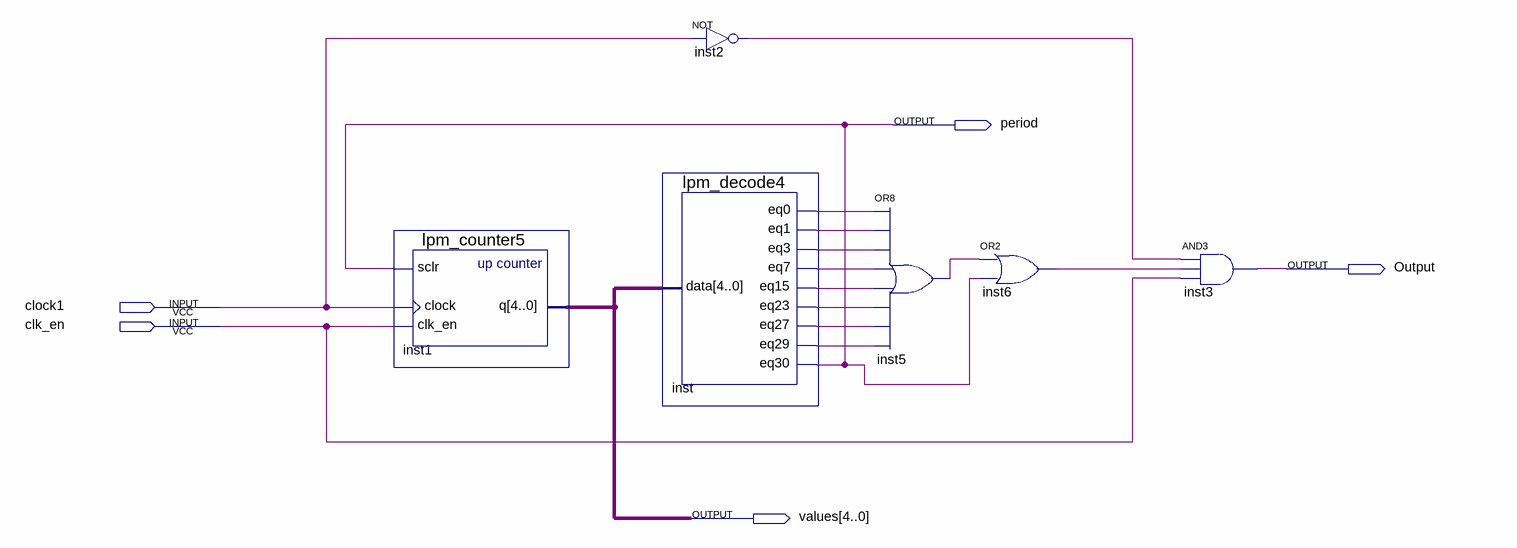
[diagram p0: schematic sheet]
// Quartus schematic DEC_COUNT.bdf as structural Verilog: 6 symbols, 5 pins
module DEC_COUNT (
  input  clock1,
  input  clk_en,
  output period,
  output Output,
  output [4:0] values
);

  wire inst2_out, inst5_out, inst6_out, inst_eq0, inst_eq1, inst_eq3, inst_eq7, inst_eq15, inst_eq23,
       inst_eq27, inst_eq29;

  lpm_counter5 inst1 (.sclr(period), .clock(clock1), .clk_en(clk_en), .q(values));
  not inst2 (inst2_out, clock1);
  lpm_decode4 inst (
    .data(values), .eq0(inst_eq0), .eq1(inst_eq1), .eq3(inst_eq3), .eq7(inst_eq7), .eq15(inst_eq15),
    .eq23(inst_eq23), .eq27(inst_eq27), .eq29(inst_eq29), .eq30(period));
  or inst5 (inst5_out, inst_eq0, inst_eq1, inst_eq3, inst_eq7, inst_eq15, inst_eq23, inst_eq27, inst_eq29);
  or inst6 (inst6_out, inst5_out, period);
  and inst3 (Output, inst2_out, inst6_out, clk_en);
endmodule
